# Altium schematic sheet SMPS.SchDoc: LiOn Drill Charger (part 2 of 3)
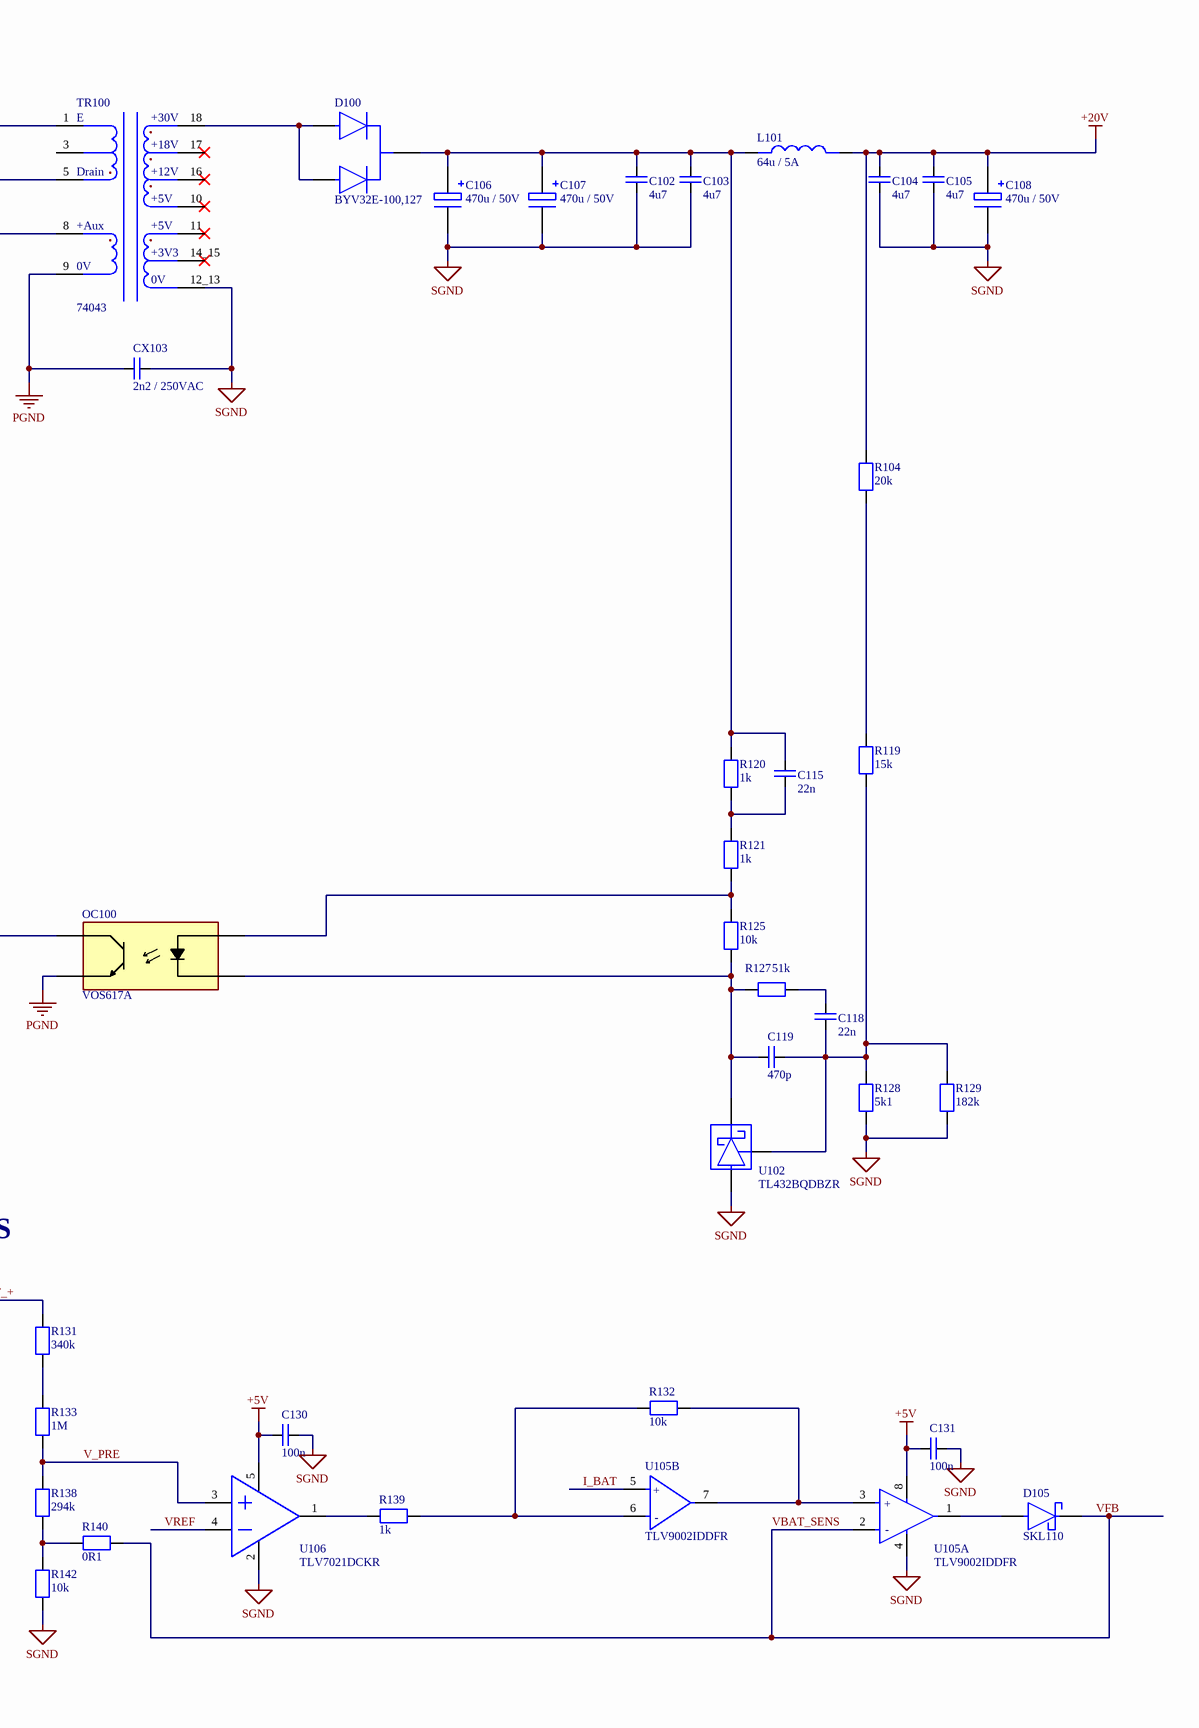
[diagram p2: SMPS.SchDoc, right]
## Library data of the parts
C100 C101 = UCY2G101MHD: Cap Aluminum Lytic 100uF 400V 20% (16 X 35.5mm) Radial 7.5mm 850mA 12000h 105C Automotive Bulk; Manufacturer: Nichicon; Dielectric Material: Aluminium; Life (Hours): 10000Hour; Dissipation Factor: 0.24%; Leakage Current: 100uA; Lead Diameter: 0.8mm; Lead Length: 19mm; Supplier: Rs; Supplier Part Number: 2437275; Manufacturer Part Number: UCY2G101MHD; RoHS: Yes; Category: Aluminum Electrolytic Capacitors; Stock: 1200; Mounting Technology: Through Hole; Case/Package: Radial; Pins: 2; Min Operating Temperature: -40°C; Max Operating Temperature: 105°C; Value: 100uF; Tolerance: 20%; Ripple Current: 850mA; Package Quantity: 50; Voltage Rating: 400V; Packaging: Bulk; Voltage Rating (DC): 400V; Termination: Radial; Features: General Purpose; Series: CY; Ripple Current (AC): 850mA; Diameter: 16mm; Length: 35.5mm; Height: 35.5mm; Lead Pitch: 7.5mm; Height - Seated (Max): 1.457inch; Radiation Hardening: No; RoHS Compliant: Yes; Reach SVHC Compliant: No; ComponentLink1URL: https://datasheet.ciiva.com/29549/e-cy-29549270.pdf?src-supplier=Digi-Key; ComponentLink1Description: https://datasheet.ciiva.com/29549/e-cy-29549270.pdf?src-supplier=Digi-Key; ComponentLink2URL: https://datasheet.ciiva.com/7907/51405-7907211.pdf?src-supplier=Element14; ComponentLink2Description: https://datasheet.ciiva.com/7907/51405-7907211.pdf?src-supplier=Element14
C102-C105 C121 C124-C126 C128 C129 = CL21A475KBQNNNE: CAP CER 4.7UF 50V X5R 0805; Manufacturer: Samsung; Tolerance: 10%; Supplier: Arrow Electronics; Supplier Part Number: CL21A475KBQNNNE; Manufacturer Part Number: CL21A475KBQNNNE; RoHS: Yes; Category: Ceramic Capacitors; Stock: 102000; Pricing: 2000=0,0433, 4000=0,0472, 10000=0,0427, 14000=0,0384, 50000=0,0353, 100000=0,0321 (USD); Mounting Technology: Surface Mount; Case/Package: 0805; Case Code (Metric): 2012; Case Code (Imperial): 0805; Min Operating Temperature: -55°C; Max Operating Temperature: 85°C; Packaging: Tape and Reel; Value: 4.7uF; Voltage Rating: 50V; Series: CL; Package Quantity: 1; Dielectric: X5R; Length: 2mm; Width: 0.049inch; Thickness: 0.055inch; Depth: 1.25mm; Radiation Hardening: No; RoHS Compliant: Yes; ComponentLink1URL: https://datasheet.ciiva.com/25797/cl21a475kbqnnne-25797730.pdf?src-supplier=Digi-Key; ComponentLink1Description: https://datasheet.ciiva.com/25797/cl21a475kbqnnne-25797730.pdf?src-supplier=Digi-Key; ComponentLink2URL: https://datasheet.ciiva.com/16428/cl21a475kbqnnne-16428877.pdf?src-supplier=Future+Electronics; ComponentLink2Description: https://datasheet.ciiva.com/16428/cl21a475kbqnnne-16428877.pdf?src-supplier=Future+Electronics; ComponentLink3URL: https://datasheet.ciiva.com/26838/getdatasheetpartid-470982-26838620.pdf?src-supplier=Verical; ComponentLink3Description: https://datasheet.ciiva.com/26838/getdatasheetpartid-470982-26838620.pdf?src-supplier=Verical
C106-C108 = PF1H471MNN1220: Kondensator: elektrolityczny; THT; 470uF; 50VDC; Ø12,5x20mm; ±20%; Manufacturer Part Number: PF1H471MNN1220
C109 = MC1206B472K102CT: MULTICOMP         MC1206B472K102CT             SMD Multilayer Ceramic Capacitor, 1206 [3216 Metric], 4700 pF, 1 kV,  10%, X7R, MC Series; Value: 4.7nF; Supplier: Farnell; Supplier Part Number: 1855900; Manufacturer: Multicomp; Manufacturer Part Number: MC1206B472K102CT; RoHS: Yes; Category: Capacitors; Stock: 3235; Pins: 2; Case Code (Metric): 3216; Case Code (Imperial): 1206; Min Operating Temperature: -55°C; Max Operating Temperature: 125°C; Packaging: Cut Tape; Tolerance: 10%; Voltage Rating: 1kV; Dielectric: X7R; Voltage Rating (DC): 1kV; RoHS Compliant: Yes; Reach SVHC Compliant: No; ComponentLink1URL: https://datasheet.ciiva.com/6161/1480386-6161102.pdf?src-supplier=Farnell; ComponentLink1Description: https://datasheet.ciiva.com/6161/1480386-6161102.pdf?src-supplier=Farnell; ComponentLink2URL: https://datasheet.ciiva.com/6161/1480386-6161095.pdf?src-supplier=Farnell; ComponentLink2Description: https://datasheet.ciiva.com/6161/1480386-6161095.pdf?src-supplier=Farnell; ComponentLink3URL: https://datasheet.ciiva.com/46384/1876948-46384360.pdf?src-supplier=Element14; ComponentLink3Description: https://datasheet.ciiva.com/46384/1876948-46384360.pdf?src-supplier=Element14
C110 C111 = EKM107M2AG20RRSHP: Kondensator: elektrolityczny; THT; 100uF; 100VDC; Ø10x20mm; ±20%
C112 C113 = FKP2O101001D00JO00: Kondensator: polipropylenowy; 100pF; 4,5x6x7,2mm; THT; ±5%; 5mm; Manufacturer: WIMA; Supplier: Mouser; Supplier Part Number: 505-FKP2O101001D00JO; Manufacturer Part Number: FKP2O101001D00JO00; RoHS: Yes; Stock: 5923; Pricing: 1=0,55, 10=0,384, 50=0,384, 100=0,254, 1000=0,16, 10000=0,14 (USD)
C114 C116 C117 C120 C122 C123 C127 C130 C131 = CC1206KKX7R0BB104: 1206 0.1 uF 100 V ±10% Tolerance X7R SMT Multilayer Ceramic Capacitor; Manufacturer: Yageo; Voltage: 63V; Value: 100nF; Voltage Rating: 100V; Supplier: Arrow Electronics; Supplier Part Number: CC1206KKX7R0BB104; Manufacturer Part Number: CC1206KKX7R0BB104; RoHS: Yes; Category: Ceramic Capacitors; Stock: 512; Pricing: 1=0,1044, 10=0,1034, 25=0,1024, 100=0,0549, 250=0,0544, 500=0,0385, 1000=0,0319, 3000=0,0261 (USD); Mounting Technology: Surface Mount; Case/Package: 1206; Pins: 2; Case Code (Metric): 3216; Case Code (Imperial): 1206; Dielectric Material: Ceramic; Min Operating Temperature: -55°C; Max Operating Temperature: 125°C; Package Quantity: 1; Tolerance: 10%; Packaging: Tape and Reel; Dielectric: X7R; Series: CC; Voltage Rating (DC): 100V; Termination: SMD/SMT; Length: 3.2mm; Width: 0.063inch; Height: 1.25mm; Depth: 1.6mm; Thickness: 0.057inch; Radiation Hardening: No; RoHS Compliant: Yes; Reach SVHC Compliant: No; Lead Free: Lead Free; ComponentLink1URL: https://datasheet.ciiva.com/7978/1447671-7978227.pdf?src-supplier=Element14; ComponentLink1Description: https://datasheet.ciiva.com/7978/1447671-7978227.pdf?src-supplier=Element14; ComponentLink2URL: https://datasheet.ciiva.com/46391/1919308-46391993.pdf?src-supplier=Element14; ComponentLink2Description: https://datasheet.ciiva.com/46391/1919308-46391993.pdf?src-supplier=Element14; ComponentLink3URL: https://datasheet.ciiva.com/180/mlccorderingcode-180145.pdf?src-supplier=Digi-Key; ComponentLink3Description: https://datasheet.ciiva.com/180/mlccorderingcode-180145.pdf?src-supplier=Digi-Key; ComponentLink4URL: https://datasheet.ciiva.com/180/mlccorderingcode-180144.pdf?src-supplier=Digi-Key; ComponentLink4Description: https://datasheet.ciiva.com/180/mlccorderingcode-180144.pdf?src-supplier=Digi-Key; ComponentLink5URL: https://datasheet.ciiva.com/180/mlccorderingcode-180146.pdf?src-supplier=Digi-Key; ComponentLink5Description: https://datasheet.ciiva.com/180/mlccorderingcode-180146.pdf?src-supplier=Digi-Key; ComponentLink6URL: https://datasheet.ciiva.com/5425/upy-gp-np0-16v-to-50v-8-5425573.pdf?src-supplier=Mouser; ComponentLink6Description: https://datasheet.ciiva.com/5425/upy-gp-np0-16v-to-50v-8-5425573.pdf?src-supplier=Mouser; ComponentLink7URL: https://datasheet.ciiva.com/16981/upy-np0x7r-mv-100-to-630v-9-16981180.pdf?src-supplier=Future+Electronics; ComponentLink7Description: https://datasheet.ciiva.com/16981/upy-np0x7r-mv-100-to-630v-9-16981180.pdf?src-supplier=Future+Electronics; ComponentLink8URL: https://datasheet.ciiva.com/26829/getdatasheetpartid-403790-26829655.pdf?src-supplier=Verical; ComponentLink8Description: https://datasheet.ciiva.com/26829/getdatasheetpartid-403790-26829655.pdf?src-supplier=Verical
C115 C118 = 06035C223K4T2A: Cap Ceramic 0.022uF 50V X7R 10% SMD 0603 125C Paper T/R; Manufacturer: Kyocera AVX; Value: 22nF; Supplier: Arrow Electronics; Supplier Part Number: 06035C223K4T2A; Manufacturer Part Number: 06035C223K4T2A; RoHS: Yes; Category: Ceramic Capacitors; Stock: 552000; Pricing: 4000=0,0111, 8000=0,0091, 12000=0,009, 20000=0,0089, 24000=0,0088, 100000=0,0061 (USD); Mounting Technology: Surface Mount; Case/Package: 0603; Case Code (Imperial): 0603; Case Code (Metric): 1608; Min Operating Temperature: -55°C; Max Operating Temperature: 125°C; Tolerance: 10%; Dielectric: X7R; Voltage Rating (DC): 50V; Packaging: Tape and Reel; Package Quantity: 1; Voltage Rating: 50V; Termination: SMD/SMT; Series: -; Length: 1.6mm; Width: 0.032inch; Thickness: 0.035inch; Depth: 0.81mm; Ratings: AEC-Q200; Radiation Hardening: No; Lead Free: Lead Free; RoHS Compliant: Yes; ComponentLink1URL: https://datasheet.ciiva.com/15212/getdatasheetpartid-307471-15212309.pdf?src-supplier=Verical; ComponentLink1Description: https://datasheet.ciiva.com/15212/getdatasheetpartid-307471-15212309.pdf?src-supplier=Verical; ComponentLink2URL: https://datasheet.ciiva.com/5418/cx7r-5418087.pdf?src-supplier=Mouser; ComponentLink2Description: https://datasheet.ciiva.com/5418/cx7r-5418087.pdf?src-supplier=Mouser; ComponentLink3URL: https://datasheet.ciiva.com/6256/cx7r-6256472.pdf?src-supplier=Digi-Key; ComponentLink3Description: https://datasheet.ciiva.com/6256/cx7r-6256472.pdf?src-supplier=Digi-Key; ComponentLink4URL: https://datasheet.ciiva.com/6256/cx7r-6256473.pdf?src-supplier=Digi-Key; ComponentLink4Description: https://datasheet.ciiva.com/6256/cx7r-6256473.pdf?src-supplier=Digi-Key; ComponentLink5URL: https://datasheet.ciiva.com/6256/cx7r-6256474.pdf?src-supplier=Digi-Key; ComponentLink5Description: https://datasheet.ciiva.com/6256/cx7r-6256474.pdf?src-supplier=Digi-Key
C119 = 06035A471JAT2A: 0603 470 pF 50 V ±5 % Tolerance C0G/NP0 SMT Multilayer Ceramic Capacitor; Manufacturer: Kyocera AVX; Value: 470pF; Tolerance: 5%; Dielectric: C0G; Voltage Rating (DC): 50V; Insulation Resistance: 100GR; Temperature Coefficient: 30ppm/°C; Supplier: Arrow Electronics; Supplier Part Number: 06035A471JAT2A; Manufacturer Part Number: 06035A471JAT2A; RoHS: Yes; Category: Ceramic Capacitors; Stock: 6810; Pricing: 1=0,0696, 10=0,0482, 25=0,0477, 100=0,0284, 250=0,0283, 500=0,0236, 1000=0,0191, 3000=0,0168, 6000=0,0167 (USD); Mounting Technology: Surface Mount,PCB; Case/Package: 0603; Pins: 2; Case Code (Imperial): 0603; Case Code (Metric): 1608; Min Operating Temperature: -55°C; Max Operating Temperature: 125°C; Packaging: Tape and Reel; Voltage: 50V; Voltage Rating: 50V; Package Quantity: 4000; Termination: SMD/SMT; Series: -; Length: 1.6mm; Width: 0.81mm; Height: 0.63mm; Depth: 0.81mm; Thickness: 0.034inch; Reach SVHC Compliant: No; Lead Free: Lead Free; RoHS Compliant: Yes; ComponentLink1URL: https://datasheet.ciiva.com/11787/0900766b802d4697-11787612.pdf?src-supplier=Rs; ComponentLink1Description: https://datasheet.ciiva.com/11787/0900766b802d4697-11787612.pdf?src-supplier=Rs; ComponentLink2URL: https://datasheet.ciiva.com/1124/26712-1124834.pdf?src-supplier=Element14; ComponentLink2Description: https://datasheet.ciiva.com/1124/26712-1124834.pdf?src-supplier=Element14; ComponentLink3URL: https://datasheet.ciiva.com/1124/26712-1124788.pdf?src-supplier=Element14; ComponentLink3Description: https://datasheet.ciiva.com/1124/26712-1124788.pdf?src-supplier=Element14; ComponentLink4URL: https://datasheet.ciiva.com/5413/ccog-243403-5413894.pdf?src-supplier=Mouser; ComponentLink4Description: https://datasheet.ciiva.com/5413/ccog-243403-5413894.pdf?src-supplier=Mouser; ComponentLink5URL: https://datasheet.ciiva.com/16290/ccog-16290950.pdf?src-supplier=Future+Electronics; ComponentLink5Description: https://datasheet.ciiva.com/16290/ccog-16290950.pdf?src-supplier=Future+Electronics; ComponentLink6URL: https://datasheet.ciiva.com/150/ccog-150440.pdf?src-supplier=Digi-Key; ComponentLink6Description: https://datasheet.ciiva.com/150/ccog-150440.pdf?src-supplier=Digi-Key; ComponentLink7URL: https://datasheet.ciiva.com/150/ccog-150441.pdf?src-supplier=Digi-Key; ComponentLink7Description: https://datasheet.ciiva.com/150/ccog-150441.pdf?src-supplier=Digi-Key; ComponentLink8URL: https://datasheet.ciiva.com/150/ccog-150442.pdf?src-supplier=Digi-Key; ComponentLink8Description: https://datasheet.ciiva.com/150/ccog-150442.pdf?src-supplier=Digi-Key; ComponentLink9URL: https://datasheet.ciiva.com/14600/70001039-14600970.pdf?src-supplier=Allied+Electronics; ComponentLink9Description: https://datasheet.ciiva.com/14600/70001039-14600970.pdf?src-supplier=Allied+Electronics; ComponentLink10URL: https://datasheet.ciiva.com/14587/70001039-14587403.pdf?src-supplier=Allied+Electronics; ComponentLink10Description: https://datasheet.ciiva.com/14587/70001039-14587403.pdf?src-supplier=Allied+Electronics; ComponentLink11URL: https://datasheet.ciiva.com/28546/759117-28546589.pdf?src-supplier=Element14; ComponentLink11Description: https://datasheet.ciiva.com/28546/759117-28546589.pdf?src-supplier=Element14; ComponentLink12URL: https://datasheet.ciiva.com/2987/ccog-2987806.pdf?src-supplier=Avnet; ComponentLink12Description: https://datasheet.ciiva.com/2987/ccog-2987806.pdf?src-supplier=Avnet
CMC100 = EV28-1.5-02-20M: Suppression Choke, Common Mode, 1.5 A , DCR Thru-Hole, Pin, EV/EH Series; Manufacturer: Schaffner; Tolerance: 30%; Value: 20mH; Shielding: Unshielded; Number of Lines: 2; Test Frequency: 10kHz; Voltage Rating (AC): 250V; Self Resonant Frequency: 400Hz; ESR: 282mR; Lead Diameter: 0.8mm; Supplier: Arrow Electronics; Supplier Part Number: EV28-1.5-02-20M; Manufacturer Part Number: EV28-1.5-02-20M; RoHS: Yes; Category: Common Mode Chokes; Stock: 69; Pricing: 1=1,508, 10=1,4774, 25=1,3975, 50=1,3848, 100=1,2728, 500=1,2056 (USD); Mounting Technology: Through Hole; Case/Package: Radial; Min Operating Temperature: -25°C; Max Operating Temperature: 100°C; Max DC Current: 1.5A; Lead/Base Style: Pin; Package Quantity: 96; Packaging: Bulk; Current Rating: 1.5A; Termination: Radial; Max Current Rating: 1.5A; Series: EV; Length: 29.2mm; Width: 21mm; Height: 34.7mm; Depth: 22mm; Lead Pitch: 13mm; Lead Free: Lead Free; RoHS Compliant: Yes; ComponentLink1URL: https://datasheet.ciiva.com/6214/ev2feh+series-6214565.pdf?src-supplier=Digi-Key; ComponentLink1Description: https://datasheet.ciiva.com/6214/ev2feh+series-6214565.pdf?src-supplier=Digi-Key
CX100-CX103 = DE2E3KY222MA3BM02F: Cap Ceramic Suppression X1/Y2 0.0022uF 250VAC E 20% (8 X 5mm) Radial 7.5mm 125 Bulk; Manufacturer: Murata; Value: 2.2nF; Lead/Base Style: Formed Leads; Ratings: X1,Y2; Supplier: Mouser; Supplier Part Number: 81-DE2E3KY222MA3BM2F; Manufacturer Part Number: DE2E3KY222MA3BM02F; RoHS: Yes; Category: Ceramic Capacitors; Stock: 2658; Pricing: 1=0,56, 10=0,371, 50=0,371, 100=0,223, 1000=0,166, 10000=0,166 (USD); Mounting Technology: Through Hole; Case/Package: Radial; Min Operating Temperature: -40°C; Max Operating Temperature: 125°C; Package Quantity: 250; Packaging: Bulk; Tolerance: 20%; Series: KY; Height - Seated (Max): 0.433inch; Lead Pitch: 0.295inch; Reach SVHC Compliant: No; Lead Free: Lead Free; RoHS Compliant: Yes; ComponentLink1URL: https://datasheet.ciiva.com/41797/l0015e-41797324.pdf?src-supplier=Digi-Key; ComponentLink1Description: https://datasheet.ciiva.com/41797/l0015e-41797324.pdf?src-supplier=Digi-Key; ComponentLink2URL: https://datasheet.ciiva.com/29535/c85e-29535582.pdf?src-supplier=Digi-Key; ComponentLink2Description: https://datasheet.ciiva.com/29535/c85e-29535582.pdf?src-supplier=Digi-Key
D100 = BYV32E-100,127: Diode Switching 100V 20A 3-Pin(3+Tab) TO-220AB Tube; Manufacturer: NXP Semiconductors; Max Reverse Current: 30uA; Reverse Recovery Time: 25ns; Peak Non-Repetitive Surge Current: 137A; Supplier: Newark; Supplier Part Number: 70R3674; Manufacturer Part Number: BYV32E-100,127; RoHS: Yes; Category: Rectifier Diodes; Mounting Technology: Through Hole; Case/Package: TO-220AB; Pins: 3; Min Operating Temperature: -40°C; Max Operating Temperature: 150°C; Packaging: Rail/Tube; Forward Current: 20A; Max Repetitive Reverse Voltage (Vrrm): 100V; Package Quantity: 50; Max Surge Current: 137A; Recovery Time: 25ns; Average Rectified Current: 20A; Reverse Voltage: 100V; Max Reverse Voltage (DC): 100V; Radiation Hardening: No; RoHS Compliant: Yes; ComponentLink1URL: https://datasheet.ciiva.com/23719/byv32e-100-23719120.pdf?src-supplier=Newark; ComponentLink1Description: https://datasheet.ciiva.com/23719/byv32e-100-23719120.pdf?src-supplier=Newark; ComponentLink2URL: https://datasheet.ciiva.com/4453/byv32e-100-115058-4453089.pdf?src-supplier=Mouser; ComponentLink2Description: https://datasheet.ciiva.com/4453/byv32e-100-115058-4453089.pdf?src-supplier=Mouser; ComponentLink3URL: https://datasheet.ciiva.com/905/byv32e-100-905747.pdf?src-supplier=Digi-Key; ComponentLink3Description: https://datasheet.ciiva.com/905/byv32e-100-905747.pdf?src-supplier=Digi-Key
D101 = S1M: VR=1000V IF=1A 6.6pF Trr=1.8us P=1.4W; Manufacturer: ON Semiconductor / Fairchild; Reverse Recovery Time: 1.8us; Average Rectified Current: 1A; Max Reverse Voltage (DC): 1kV; Forward Voltage: 1V; Peak Non-Repetitive Surge Current: 30A; Max Reverse Current: 1uA; Recovery Time: 1800ns; Max Surge Current: 40A; Polarity: Standard; Value: 12pF; Power Dissipation: 1.4W; Supplier: Arrow Electronics; Supplier Part Number: S1M; Manufacturer Part Number: S1M; RoHS: Yes; Category: Rectifier Diodes; Stock: 1252500; Pricing: 7500=0,0565, 15000=0,0556, 37500=0,0552, 52500=0,049, 187500=0,0471 (USD); Mounting Technology: Surface Mount; Case/Package: SMA; Pins: 2; Min Operating Temperature: -55°C; Max Operating Temperature: 150°C; Packaging: Tape and Reel; Series: -; Package Quantity: 7500; Max Repetitive Reverse Voltage (Vrrm): 1kV; Forward Current: 1A; Max Forward Surge Current (Ifsm): 30A; Voltage Rating (DC): 1kV; Current Rating: 1A; Output Current: 1A; Termination: SMD/SMT; Current: 1A; Voltage: 1kV; Reverse Voltage: 1kV; Length: 4.75mm; Width: 5.28mm; Height: 2.2mm; Radiation Hardening: No; RoHS Compliant: No; Lead Free: Lead Free; Reach SVHC Compliant: No
D102 D105 = SKL110: Schottky Diode, SOD-123FL, 100V, 1.00A; Manufacturer: Diotec; Supplier: Mouser; Supplier Part Number: 637-SKL110; Manufacturer Part Number: SKL110; RoHS: Yes; Category: Schottky Diodes; Stock: 5538; Pricing: 1=1,49, 10=0,495, 50=0,495, 100=0,355, 1000=0,248, 10000=0,18 (USD)
D103 = BAV21W-TP: Rectifier Diode Small Signal Switching 250V 0.25A 50ns 2-Pin SOD-123 T/R; Manufacturer: MCC; Max Surge Current: 1A; Average Rectified Current: 200mA; Max Reverse Current: 100nA; Power Dissipation: 225mW; Polarity: Standard; Value: 1.5pF; Max Reverse Voltage (DC): 200V; Supplier: Arrow Electronics; Supplier Part Number: BAV21W-TP; Manufacturer Part Number: BAV21W-TP; RoHS: Yes; Category: Rectifier Diodes; Stock: 1191000; Pricing: 3000=0,0322, 9000=0,0271, 24000=0,0247, 45000=0,0217 (USD); Mounting Technology: Surface Mount; Pins: 2; Min Operating Temperature: -55°C; Max Operating Temperature: 150°C; Package Quantity: 3000; Packaging: Tape and Reel; Recovery Time: 50ns; Reverse Recovery Time: 50ns; Voltage Rating (DC): 250V; Current Rating: 200mA; Output Current: 200mA; Voltage: 250V; Reverse Voltage: 250V; Series: -; Length: 3.04mm; Width: 1.4mm; Height: 1.12mm; Lead Free: Lead Free; RoHS Compliant: Yes; ComponentLink1URL: https://datasheet.ciiva.com/911/bav19w-bav21wsod-123-911766.pdf?src-supplier=Digi-Key; ComponentLink1Description: https://datasheet.ciiva.com/911/bav19w-bav21wsod-123-911766.pdf?src-supplier=Digi-Key; ComponentLink2URL: https://datasheet.ciiva.com/911/bav19w-bav21wsod-123-911767.pdf?src-supplier=Digi-Key; ComponentLink2Description: https://datasheet.ciiva.com/911/bav19w-bav21wsod-123-911767.pdf?src-supplier=Digi-Key; ComponentLink3URL: https://datasheet.ciiva.com/14557/70055583-14557980.pdf?src-supplier=Allied+Electronics; ComponentLink3Description: https://datasheet.ciiva.com/14557/70055583-14557980.pdf?src-supplier=Allied+Electronics
D104 = B340LA-13-F: VR=40V IF=3A 200pF; Manufacturer: Diodes; Forward Current: 3A; Max Reverse Current: 2mA; Max Repetitive Reverse Voltage (Vrrm): 40V; Peak Non-Repetitive Surge Current: 70A; Forward Voltage: 450mV; Polarity: Standard; Value: 180pF; Supplier: Arrow Electronics; Supplier Part Number: B340LA-13-F; Manufacturer Part Number: B340LA-13-F; RoHS: Yes; Category: Rectifier Diodes; Stock: 1645; Pricing: 1=0,4591 (USD); Mounting Technology: Surface Mount; Case/Package: SMA; Pins: 2; Weight: 0.002258oz; Min Operating Temperature: -55°C; Max Operating Temperature: 125°C; Packaging: Tape and Reel; Termination: SMD/SMT; Series: -; Package Quantity: 5000; Average Rectified Current: 3A; Max Forward Surge Current (Ifsm): 70A; Voltage Rating (DC): 40V; Current Rating: 3A; Output Current: 3A; Max Reverse Voltage (DC): 40V; Length: 4.6mm; Width: 2.92mm; Height: 2.1mm; Radiation Hardening: No; Reach SVHC Compliant: No; Lead Free: Lead Free; RoHS Compliant: Yes; ComponentLink1URL: https://datasheet.ciiva.com/34302/1538881-34302359.pdf?src-supplier=Jameco; ComponentLink1Description: https://datasheet.ciiva.com/34302/1538881-34302359.pdf?src-supplier=Jameco; ComponentLink2URL: https://datasheet.ciiva.com/26949/getdatasheetpartid-256588-26949354.pdf?src-supplier=Verical; ComponentLink2Description: https://datasheet.ciiva.com/26949/getdatasheetpartid-256588-26949354.pdf?src-supplier=Verical; ComponentLink3URL: https://datasheet.ciiva.com/1177/ds30240-1177478.pdf?src-supplier=Element14; ComponentLink3Description: https://datasheet.ciiva.com/1177/ds30240-1177478.pdf?src-supplier=Element14; ComponentLink4URL: https://datasheet.ciiva.com/16449/ds30240-16449494.pdf?src-supplier=Future+Electronics; ComponentLink4Description: https://datasheet.ciiva.com/16449/ds30240-16449494.pdf?src-supplier=Future+Electronics; ComponentLink5URL: https://datasheet.ciiva.com/914/ds30240-914393.pdf?src-supplier=Digi-Key; ComponentLink5Description: https://datasheet.ciiva.com/914/ds30240-914393.pdf?src-supplier=Digi-Key; ComponentLink6URL: https://datasheet.ciiva.com/914/ds30240-914394.pdf?src-supplier=Digi-Key; ComponentLink6Description: https://datasheet.ciiva.com/914/ds30240-914394.pdf?src-supplier=Digi-Key; ComponentLink7URL: https://datasheet.ciiva.com/914/ds30240-914392.pdf?src-supplier=Digi-Key; ComponentLink7Description: https://datasheet.ciiva.com/914/ds30240-914392.pdf?src-supplier=Digi-Key
DBR100 = KBP206G: Rectifier Bridge Diode Single 600V 2A 4-Pin Case KBP Tube / RECT BRIDGE GPP 600V 2A KBP; Manufacturer: Diodes; Max Reverse Current: 5uA; Max Surge Current: 65A; Forward Voltage: 1.1V; Number of Elements: 1; Reverse Voltage (DC): 420V; Value: 25pF; Supplier: Arrow Electronics; Supplier Part Number: KBP206G; Manufacturer Part Number: KBP206G; RoHS: Yes; Category: Rectifier Diodes; Stock: 129086; Pricing: 1=0,1378, 10=0,1346, 100=0,1305, 500=0,1294 (USD); Mounting Technology: Through Hole; Pins: 4; Min Operating Temperature: -65°C; Max Operating Temperature: 150°C; Forward Current: 2A; Packaging: Rail/Tube; Package Quantity: 35; Max Repetitive Reverse Voltage (Vrrm): 600V; Max Forward Surge Current (Ifsm): 65A; Average Rectified Current: 2A; Peak Non-Repetitive Surge Current: 65A; Termination: Through Hole; Current Rating: 2A; Voltage Rating (DC): 600V; Output Current: 2A; Series: -; Length: 14.75mm; Width: 3.65mm; Height: 10.6mm; Radiation Hardening: No; Lead Free: Lead Free; RoHS Compliant: Yes; ComponentLink1URL: https://datasheet.ciiva.com/27052/1540480-27052403.pdf?src-supplier=Jameco; ComponentLink1Description: https://datasheet.ciiva.com/27052/1540480-27052403.pdf?src-supplier=Jameco; ComponentLink2URL: https://datasheet.ciiva.com/11195/ds21205-11195751.pdf?src-supplier=Avnet; ComponentLink2Description: https://datasheet.ciiva.com/11195/ds21205-11195751.pdf?src-supplier=Avnet; ComponentLink3URL: https://datasheet.ciiva.com/885/ds21205-885834.pdf?src-supplier=Digi-Key; ComponentLink3Description: https://datasheet.ciiva.com/885/ds21205-885834.pdf?src-supplier=Digi-Key; ComponentLink4URL: https://datasheet.ciiva.com/15145/getdatasheetpartid-244272-15145387.pdf?src-supplier=Verical; ComponentLink4Description: https://datasheet.ciiva.com/15145/getdatasheetpartid-244272-15145387.pdf?src-supplier=Verical
F100 = 0001.2707.11: Fuse Miniature Slow Blow Acting 2A 250V Holder Cartridge 5 X 20mm Ceramic Bag CCC/VDE/cULus; Manufacturer: Schurter; Voltage Rating (DC): 300V; Max Power Dissipation: 2.5W; Fuse Type: Cartridge, Ceramic; Fuse Size: 5 x 20mm; Blow Characteristic: TIME DELAY; Approvals: VDE,cURus,CCC; Supplier: Farnell; Supplier Part Number: 4448352; Manufacturer Part Number: 0001.2707.11; RoHS: Yes; Category: Fuses; Stock: 2569; Mounting Technology: Surface Mount,Holder; Case/Package: SMD/SMT; Pins: 2; Weight: 0.035274oz; Body Material: Ceramic; Contact Material: Copper; Contact Plating: Gold; Min Operating Temperature: -55°C; Max Operating Temperature: 125°C; Packaging: Bulk; Current Rating: 2A; Voltage Rating (AC): 250V; Package Quantity: 100; Max Voltage Rating (AC): 250V; Max Voltage Rating (DC): 300V; Current: 2A; Fuse Current: 2A; Voltage Rating: 250V; Series: SMD-SPT; Diameter: 5.2mm; Length: 20mm; Reach SVHC Compliant: No; Lead Free: Lead Free; RoHS Compliant: Yes; ComponentLink1URL: https://datasheet.ciiva.com/3018/typ-smd-spt-3018464.pdf?src-supplier=Avnet; ComponentLink1Description: https://datasheet.ciiva.com/3018/typ-smd-spt-3018464.pdf?src-supplier=Avnet; ComponentLink2URL: https://datasheet.ciiva.com/4486/typ-smd-spt-245512-4486065.pdf?src-supplier=Mouser; ComponentLink2Description: https://datasheet.ciiva.com/4486/typ-smd-spt-245512-4486065.pdf?src-supplier=Mouser; ComponentLink3URL: https://datasheet.ciiva.com/1223/typ-smd-spt-1223716.pdf?src-supplier=Newark; ComponentLink3Description: https://datasheet.ciiva.com/1223/typ-smd-spt-1223716.pdf?src-supplier=Newark; ComponentLink4URL: https://datasheet.ciiva.com/7480/typ-smd-spt-7480053.pdf?src-supplier=Digi-Key; ComponentLink4Description: https://datasheet.ciiva.com/7480/typ-smd-spt-7480053.pdf?src-supplier=Digi-Key; ComponentLink5URL: https://datasheet.ciiva.com/14645/smd-spt-eng-tds-14645957.pdf?src-supplier=Distrelec; ComponentLink5Description: https://datasheet.ciiva.com/14645/smd-spt-eng-tds-14645957.pdf?src-supplier=Distrelec; ComponentLink6URL: https://datasheet.ciiva.com/30182/20typ-smd-spt-30182278.pdf?src-supplier=Onlinecomponents.com; ComponentLink6Description: https://datasheet.ciiva.com/30182/20typ-smd-spt-30182278.pdf?src-supplier=Onlinecomponents.com; ComponentLink7URL: https://datasheet.ciiva.com/48967/70427025-48967127.pdf?src-supplier=Allied+Electronics; ComponentLink7Description: https://datasheet.ciiva.com/48967/70427025-48967127.pdf?src-supplier=Allied+Electronics
L100 = DPO-3.0-22: Fixed Ind 22UH 3A 50 Mohm Th; Manufacturer: Nuvotem; Shielding: Unshielded; DC Resistance (DCR): 50mR; Test Frequency: 10kHz; Supplier: Digi-Key; Supplier Part Number: 1295-1173-ND; Manufacturer Part Number: DPO-3.0-22; RoHS: Yes; Category: Fixed Inductors; Pricing: 1500=0,93 (USD); Mounting Technology: Through Hole; Case/Package: Radial; Min Operating Temperature: -40°C; Max Operating Temperature: 125°C; Packaging: Tray; Value: 22uH; Series: DP; RoHS Compliant: Yes; ComponentLink1URL: http://www.talema.com/uploads/documents/product-datasheets/DP%20Series.pdf?src-supplier=Digi-Key; ComponentLink1Description: http://www.talema.com/uploads/documents/product-datasheets/DP%20Series.pdf?src-supplier=Digi-Key
L101 = DLV-640-M5.0: Dławik: drutowy; THT; 64uH; 5A; 60mΩ; Manufacturer Part Number: DLV-640-M5.0
L102 = 7440650047: Power Choke Shielded Wirewound 4.7uH 30% 100KHz Ferrite 4.6A 23mOhm DCR T/R; Manufacturer: Wurth Electronics; Self Resonant Frequency: 40MHz; Saturation Current: 4.2A; DC Resistance (DCR): 23mR; Supplier: Rs; Supplier Part Number: 6690280; Manufacturer Part Number: 7440650047; RoHS: Yes; Category: Fixed Inductors; Stock: 425; Mounting Technology: Surface Mount; Case/Package: Nonstandard; Pins: 2; Weight: 0.031076oz; Core Material: Ferrite; Min Operating Temperature: -40°C; Max Operating Temperature: 125°C; Packaging: Cut Tape; Tolerance: 30%; Shielding: Shielded; Inductance Tolerance: 30%; Package Quantity: 1; Current Rating: 4.6A; Value: 4.7uH; Max DC Current: 4.6A; Termination: SMD/SMT; Test Frequency: 100kHz; RMS Current (Irms): 4.6A; Series: WE-TPC; ESR: 23mR; Length: 10mm; Width: 10mm; Height: 2.8mm; Height - Seated (Max): 0.122inch; Depth: 10mm; RoHS Compliant: Yes; Reach SVHC Compliant: Unknown; ComponentLink1URL: https://datasheet.ciiva.com/7892/1735580-7892635.pdf?src-supplier=Element14; ComponentLink1Description: https://datasheet.ciiva.com/7892/1735580-7892635.pdf?src-supplier=Element14; ComponentLink2URL: https://datasheet.ciiva.com/13320/7440650047-21682-13320928.pdf?src-supplier=Mouser; ComponentLink2Description: https://datasheet.ciiva.com/13320/7440650047-21682-13320928.pdf?src-supplier=Mouser; ComponentLink3URL: https://datasheet.ciiva.com/1058/7440650047-1058868.pdf?src-supplier=Digi-Key; ComponentLink3Description: https://datasheet.ciiva.com/1058/7440650047-1058868.pdf?src-supplier=Digi-Key; ComponentLink4URL: https://datasheet.ciiva.com/11801/0900766b80d87d95-11801992.pdf?src-supplier=Rs; ComponentLink4Description: https://datasheet.ciiva.com/11801/0900766b80d87d95-11801992.pdf?src-supplier=Rs; ComponentLink5URL: https://datasheet.ciiva.com/1058/7440650047-1058870.pdf?src-supplier=Digi-Key; ComponentLink5Description: https://datasheet.ciiva.com/1058/7440650047-1058870.pdf?src-supplier=Digi-Key; ComponentLink6URL: https://datasheet.ciiva.com/48690/001087268-da-01-ml-we-tpc-smd-speicherdrossel-7440650-de-en-48690651.pdf?src-supplier=Conrad; ComponentLink6Description: https://datasheet.ciiva.com/48690/001087268-da-01-ml-we-tpc-smd-speicherdrossel-7440650-de-en-48690651.pdf?src-supplier=Conrad
OC100 = VOS617A-X001T: Optocoupler DC-IN 1-CH Transistor DC-OUT 4-Pin SSOP T/R; Manufacturer: Vishay Semiconductors; Max Power Dissipation: 170mW; Forward Current: 50mA; Number of Channels: 1; Reverse Breakdown Voltage: 6V; Forward Voltage: 1.18V; Collector Emitter Voltage (VCEO): 80V; Collector Emitter Saturation Voltage: 400mV; Isolation Voltage: 3.75kV; Current Transfer Ratio: 600%; Input Type: DC; Supplier: Mouser; Supplier Part Number: 78-VOS617A-X001T; Manufacturer Part Number: VOS617A-X001T; RoHS: Yes; Category: Optocouplers; Stock: 3649; Pricing: 1=0,64, 10=0,391, 50=0,391, 100=0,225, 1000=0,181, 10000=0,136 (USD); Mounting Technology: Surface Mount; Case/Package: SSOP; Pins: 4; Min Operating Temperature: -55°C; Max Operating Temperature: 110°C; Packaging: Tape and Reel; Max Collector Current: 50mA; Number of Elements: 1; Power Dissipation: 170mW; Max Input Current: 50mA; Input Current: 50mA; Series: -; Max Output Voltage: 80V; Output Current per Channel: 50mA; Collector-emitter Voltage-Max: 400mV; Radiation Hardening: No; Lead Free: Lead Free; RoHS Compliant: Yes; Reach SVHC Compliant: Unknown; ComponentLink1URL: https://datasheet.ciiva.com/15011/vos617a-15011232.pdf?src-supplier=Digi-Key; ComponentLink1Description: https://datasheet.ciiva.com/15011/vos617a-15011232.pdf?src-supplier=Digi-Key; ComponentLink2URL: https://datasheet.ciiva.com/22656/1913334-22656429.pdf?src-supplier=Element14; ComponentLink2Description: https://datasheet.ciiva.com/22656/1913334-22656429.pdf?src-supplier=Element14; ComponentLink3URL: https://datasheet.ciiva.com/30032/vos617a-30032527.pdf?src-supplier=Avnet; ComponentLink3Description: https://datasheet.ciiva.com/30032/vos617a-30032527.pdf?src-supplier=Avnet
PL100-PL104 = Pole lutownicze 3mm
Q100 = 12N65: Tranzystor: N-MOSFET; unipolarny; 650V; 12A; 33,2W; TO220F; Manufacturer Part Number: 12N65
Q101 Q102 = MMBT7002K: MOSFETs (Field Effect Transistor), SOT-23, 60V, 0.3A, N, 0.350W; Manufacturer: Diotec; Continuous Drain Current (ID): 115mA; Supplier: Mouser; Supplier Part Number: 637-MMBT7002K; Manufacturer Part Number: MMBT7002K; RoHS: Yes; Category: MOSFETs; Stock: 2659; Pricing: 1=0,45, 10=0,15, 50=0,15, 100=0,108, 1000=0,075, 10000=0,054 (USD); Case/Package: SOT-23; Drain to Source Voltage (Vdss): 60V; RoHS Compliant: Yes; ComponentLink1URL: https://datasheet.ciiva.com/14092/mmbt7002k-eng-ger-ds-14092746.pdf?src-supplier=Distrelec; ComponentLink1Description: https://datasheet.ciiva.com/14092/mmbt7002k-eng-ger-ds-14092746.pdf?src-supplier=Distrelec
R100 R101 = RC1206JR-071K2L: Res Thick Film 1206 1.2K Ohm 5% 1/4W ±100ppm/°C Molded SMD SMD Paper T/R; Manufacturer: Yageo; Value: 1.2kR; Max Power Dissipation: 250mW; Voltage Rating: 200V; Supplier: Arrow Electronics; Supplier Part Number: RC1206JR-071K2L; Manufacturer Part Number: RC1206JR-071K2L; RoHS: Yes; Category: Chip SMD Resistors; Stock: 235000; Pricing: 5000=0,003 (USD); Case/Package: 1206; Case Code (Metric): 3216; Case Code (Imperial): 1206; Contact Plating: Tin,Matte; Min Operating Temperature: -55°C; Max Operating Temperature: 155°C; Tolerance: 5%; Packaging: Cut Tape; Temperature Coefficient: 100ppm/°C; Resistor Type: Thick Film; Number of Terminations: 2; Series: RC; Power Rating: 250mW; Features: Moisture Resistant; Package Quantity: 1; Termination: SMD/SMT; Resistance Tolerance: 5%; Length: 0.122inch; Width: 0.063inch; Height: 0.026inch; RoHS Compliant: Yes; Lead Free: Lead Free; Reach SVHC Compliant: Unknown; ComponentLink1URL: https://datasheet.ciiva.com/29181/402559-da-01-en-smd-widerstand-chip1206-1-2-kohm-29181465.pdf?src-supplier=Conrad; ComponentLink1Description: https://datasheet.ciiva.com/29181/402559-da-01-en-smd-widerstand-chip1206-1-2-kohm-29181465.pdf?src-supplier=Conrad; ComponentLink2URL: https://datasheet.ciiva.com/2458/pyu-r-int-thick-7-2458693.pdf?src-supplier=Digi-Key; ComponentLink2Description: https://datasheet.ciiva.com/2458/pyu-r-int-thick-7-2458693.pdf?src-supplier=Digi-Key; ComponentLink3URL: https://datasheet.ciiva.com/2458/pyu-r-int-thick-7-2458694.pdf?src-supplier=Digi-Key; ComponentLink3Description: https://datasheet.ciiva.com/2458/pyu-r-int-thick-7-2458694.pdf?src-supplier=Digi-Key; ComponentLink4URL: https://datasheet.ciiva.com/2458/pyu-r-int-thick-7-2458692.pdf?src-supplier=Digi-Key; ComponentLink4Description: https://datasheet.ciiva.com/2458/pyu-r-int-thick-7-2458692.pdf?src-supplier=Digi-Key; ComponentLink5URL: https://datasheet.ciiva.com/7857/444357-7857453.pdf?src-supplier=Element14; ComponentLink5Description: https://datasheet.ciiva.com/7857/444357-7857453.pdf?src-supplier=Element14; ComponentLink6URL: https://datasheet.ciiva.com/7857/444357-7857454.pdf?src-supplier=Element14; ComponentLink6Description: https://datasheet.ciiva.com/7857/444357-7857454.pdf?src-supplier=Element14; ComponentLink7URL: https://datasheet.ciiva.com/17201/pyu-rc1206-51-rohs-l-4-17201319.pdf?src-supplier=Future+Electronics; ComponentLink7Description: https://datasheet.ciiva.com/17201/pyu-rc1206-51-rohs-l-4-17201319.pdf?src-supplier=Future+Electronics
R102 = PMR2S-82K: Rezystor: power metal; THT; 82kΩ; 2W; ±5%; Ø4x11mm; 350ppm/°C; Manufacturer Part Number: PMR02SJ0823A10
R103 R108 = 1206S4J0150T5E: Resistor: thick film; SMD; 1206; 15O; 0.25W; ±5%; -55÷125°C; Manufacturer: Royal Electronic Factory; Supplier: Mouser; Supplier Part Number: 303-1206S4J0150T5E; Manufacturer Part Number: 1206S4J0150T5E; RoHS: Yes; Pricing: 10000=0,002 (USD); RoHS Compliant: Yes
R104 = WR06X2002FTL: Res Thick Film 0603 20K Ohm 1% 0.1W(1/10W) ±100ppm/C Pad SMD T/R; Manufacturer: Walsin Technologies; Value: 20kR; Power Rating: 100mW; Temperature Coefficient: 100ppm/°C; Voltage Rating (DC): 75V; Supplier: Arrow Electronics; Supplier Part Number: WR06X2002FTL; Manufacturer Part Number: WR06X2002FTL; RoHS: Yes; Category: Chip SMD Resistors; Stock: 1975000; Pricing: 5000=0,001 (USD); Case/Package: 0603; Case Code (Metric): 1608; Case Code (Imperial): 0603; Contact Material: Tin; Packaging: Tape and Reel; Tolerance: 1%; Resistor Type: Thick Film; Voltage Rating: 75V; Resistance Tolerance: 1%; Lead Free: Lead Free; RoHS Compliant: Yes; Reach SVHC Compliant: Unknown; ComponentLink1URL: http://www.farnell.com/datasheets/1960319.pdf?src-supplier=Farnell; ComponentLink1Description: http://www.farnell.com/datasheets/1960319.pdf?src-supplier=Farnell; ComponentLink2URL: http://www.farnell.com/datasheets/1960319.pdf?src-supplier=Element14; ComponentLink2Description: http://www.farnell.com/datasheets/1960319.pdf?src-supplier=Element14; ComponentLink3URL: http://www.farnell.com/datasheets/1960319.pdf?src-supplier=Newark; ComponentLink3Description: http://www.farnell.com/datasheets/1960319.pdf?src-supplier=Newark
R105 = 1206S4J0103T5E: Res Thick Film 1206 10K Ohm 5% 0.25W(1/4W) ±100ppm/°C Pad SMD T/R; Manufacturer: Royal Electronic Factory; Supplier: Mouser; Supplier Part Number: 303-1206S4J0103T5E; Manufacturer Part Number: 1206S4J0103T5E; RoHS: Yes; RoHS Compliant: Yes
R106 = 1206S4J0393T5E: Rezystor: thick film; SMD; 1206; 39kΩ; 0,25W; ±5%; -55÷125°C; Manufacturer: Royal Electronic Factory; Supplier: Mouser; Supplier Part Number: 303-1206S4J0393T5E; Manufacturer Part Number: 1206S4J0393T5E; RoHS: Yes; Pricing: 10000=0,002 (USD); RoHS Compliant: Yes
R107 R109 R113 = 1206S4J0332T5E: Cermet resistor 3.3 kΩ SMD 1206 0.25 W 5 % 100 ±ppm/°C Royalohm 1206S4J0332T5E 1 pc(s); Manufacturer: Royal Electronic Factory; Supplier: Mouser; Supplier Part Number: 303-1206S4J0332T5E; Manufacturer Part Number: 1206S4J0332T5E; RoHS: Yes; Pricing: 10000=0,002 (USD); RoHS Compliant: Yes; ComponentLink1URL: https://produktinfo.conrad.com/datenblaetter/1400000-1499999/001460317-da-01-en-SMD_WID_DICKSCH__1_4WS_1206_5__3K3.pdf?src-supplier=Conrad; ComponentLink1Description: https://produktinfo.conrad.com/datenblaetter/1400000-1499999/001460317-da-01-en-SMD_WID_DICKSCH__1_4WS_1206_5__3K3.pdf?src-supplier=Conrad
R110 R135 = 1206S4J0330T5E: Rezystor: thick film; SMD; 1206; 33Ω; 0,25W; ±5%; -55÷125°C; Manufacturer: Royal Electronic Factory; Supplier: Mouser; Supplier Part Number: 303-1206S4J0330T5E; Manufacturer Part Number: 1206S4J0330T5E; RoHS: Yes; Pricing: 10000=0,002 (USD)
R111 R112 = 1206S4F5104T5E: Rezystor: thick film; SMD; 1206; 5,1MΩ; 0,25W; ±1%; -55÷125°C; Manufacturer: Royal Electronic Factory; Supplier: Mouser; Supplier Part Number: 303-1206S4F5104T5E; Manufacturer Part Number: 1206S4F5104T5E; RoHS: No; Pricing: 10000=0,005 (USD)
R114 R125 R130 R132 = WF06P103JTL: Rezystor: thick film; SMD; 0603; 10kΩ; 0,125W; ±5%; -55÷155°C; Manufacturer Part Number: WF06P103JTL
R115 = 1206S4J0202T5E: Rezystor: thick film; SMD; 1206; 2kΩ; 0,25W; ±5%; -55÷125°C; Manufacturer: Royal Electronic Factory; Supplier: Mouser; Supplier Part Number: 303-1206S4J0202T5E; Manufacturer Part Number: 1206S4J0202T5E; RoHS: Yes; Pricing: 10000=0,002 (USD); RoHS Compliant: Yes
R116 R117 = 1206S4J010JT5E: Rezystor: thick film; SMD; 1206; 1Ω; 0,25W; ±5%; -55÷125°C; Manufacturer: Royal Electronic Factory; Supplier: Mouser; Supplier Part Number: 303-1206S4J010JT5E; Manufacturer Part Number: 1206S4J010JT5E; RoHS: Yes; Pricing: 10000=0,002 (USD); RoHS Compliant: Yes
R118 R127 = 0603SAJ0513T5E: Rezystor: thick film; SMD; 0603; 51kΩ; 0,1W; ±5%; -55÷155°C; Manufacturer: Royal Electronic Factory; Supplier: Mouser; Supplier Part Number: 303-0603SAJ0513T5E; Manufacturer Part Number: 0603SAJ0513T5E; RoHS: Yes; Pricing: 10000=0,001 (USD); RoHS Compliant: Yes
R119 = 0603SAJ0153T5E: 0603 15000±5% SMD Resistor; Manufacturer: Royal Electronic Factory; Supplier: Mouser; Supplier Part Number: 303-0603SAJ0153T5E; Manufacturer Part Number: 0603SAJ0153T5E; RoHS: Yes; Pricing: 10000=0,001 (USD); RoHS Compliant: Yes
R120 R121 R134 R136 R139 R143 = WF06P102JTL: Rezystor: thick film; SMD; 0603; 1kΩ; 0,125W; ±5%; -55÷155°C; Manufacturer Part Number: WF06P102JTL
R122 R126 = 0603SAJ0204T5E: Rezystor: thick film; SMD; 0603; 200kΩ; 0,1W; ±5%; -55÷155°C; Manufacturer: Royal Electronic Factory; Supplier: Mouser; Supplier Part Number: 303-0603SAJ0204T5E; Manufacturer Part Number: 0603SAJ0204T5E; RoHS: Yes; Pricing: 10000=0,001 (USD); RoHS Compliant: Yes
R123 = MC0603SAF4993T5E: MULTICOMP   MC0603SAF4993T5E   THICK FILM RESISTOR, 499KOHM, 100mW, 1%; Voltage Rating: 75V; Value: 499kR; Temperature Coefficient: 100ppm/°C; Supplier: Farnell; Supplier Part Number: 1631358; Manufacturer: Multicomp; Manufacturer Part Number: MC0603SAF4993T5E; RoHS: Yes; Category: Resistors; Case/Package: 0603; Pins: 2; Case Code (Metric): 1608; Case Code (Imperial): 0603; Power Rating: 100mW; Resistor Type: Thick Film; Packaging: Cut Tape; Voltage Rating (DC): 75V; Resistance Tolerance: 1%; Series: MC; RoHS Compliant: Yes; Reach SVHC Compliant: Unknown; ComponentLink1URL: https://datasheet.ciiva.com/7776/ta-677-7776879.pdf?src-supplier=Element14; ComponentLink1Description: https://datasheet.ciiva.com/7776/ta-677-7776879.pdf?src-supplier=Element14
R124 = ERJ-3EKF3573V: Res Thick Film 0603 357K Ohm 1% 1/10W ±100ppm/°C Molded SMD Punched Carrier T/R; Manufacturer: Panasonic; Voltage Rating: 75V; Value: 357kR; Power Rating: 100mW; Voltage Rating (DC): 50V; Supplier: Mouser; Supplier Part Number: 667-ERJ-3EKF3573V; Manufacturer Part Number: ERJ-3EKF3573V; RoHS: Yes; Category: Chip SMD Resistors; Stock: 49267; Pricing: 1=0,1, 10=0,026, 50=0,026, 100=0,012, 1000=0,009, 10000=0,005 (USD); Mounting Technology: Surface Mount; Case/Package: 0603; Case Code (Metric): 1608; Case Code (Imperial): 0603; Contact Plating: Tin; Min Operating Temperature: -55°C; Max Operating Temperature: 155°C; Packaging: Tape and Reel; Tolerance: 1%; Package Quantity: 1; Resistor Type: Thick Film; Number of Terminations: 2; Termination: SMD/SMT; Temperature Coefficient: 100ppm/°C; Max Power Dissipation: 100mW; Features: Automotive AEC-Q200; Series: ERJ; Resistance Tolerance: 1%; Construction: Rectangular; Technology: THICK FILM; Length: 1.6mm; Width: 0.8mm; Height: 0.45mm; Depth: 0.8mm; Reach SVHC Compliant: Yes; Military Standard: Not; Lead Free: Lead Free; RoHS Compliant: Yes; ComponentLink1URL: https://datasheet.ciiva.com/22673/1678782-22673989.pdf?src-supplier=Element14; ComponentLink1Description: https://datasheet.ciiva.com/22673/1678782-22673989.pdf?src-supplier=Element14; ComponentLink2URL: https://datasheet.ciiva.com/9182/aoa0000ce2-9182758.pdf?src-supplier=Avnet; ComponentLink2Description: https://datasheet.ciiva.com/9182/aoa0000ce2-9182758.pdf?src-supplier=Avnet; ComponentLink3URL: https://datasheet.ciiva.com/30192/aoa0000ce2-30192230.pdf?src-supplier=Onlinecomponents.com; ComponentLink3Description: https://datasheet.ciiva.com/30192/aoa0000ce2-30192230.pdf?src-supplier=Onlinecomponents.com; ComponentLink4URL: https://datasheet.ciiva.com/16787/70260748-16787383.pdf?src-supplier=Allied+Electronics; ComponentLink4Description: https://datasheet.ciiva.com/16787/70260748-16787383.pdf?src-supplier=Allied+Electronics; ComponentLink5URL: https://datasheet.ciiva.com/24027/aoa0000ce2-24027115.pdf?src-supplier=Mouser; ComponentLink5Description: https://datasheet.ciiva.com/24027/aoa0000ce2-24027115.pdf?src-supplier=Mouser; ComponentLink6URL: https://datasheet.ciiva.com/16778/70260748-16778909.pdf?src-supplier=Allied+Electronics; ComponentLink6Description: https://datasheet.ciiva.com/16778/70260748-16778909.pdf?src-supplier=Allied+Electronics; ComponentLink7URL: https://datasheet.ciiva.com/46373/1678782-46373405.pdf?src-supplier=Element14; ComponentLink7Description: https://datasheet.ciiva.com/46373/1678782-46373405.pdf?src-supplier=Element14; ComponentLink8URL: https://datasheet.ciiva.com/46373/1678782-46373406.pdf?src-supplier=Element14; ComponentLink8Description: https://datasheet.ciiva.com/46373/1678782-46373406.pdf?src-supplier=Element14
R128 = 0603SAJ0512T5E: 0603 5100±5% SMD Resistor; Manufacturer: Royal Electronic Factory; Supplier: Mouser; Supplier Part Number: 303-0603SAJ0512T5E; Manufacturer Part Number: 0603SAJ0512T5E; RoHS: Yes; Pricing: 10000=0,001 (USD); RoHS Compliant: Yes
R129 = 0603SAF1823T5E: Rezystor: thick film; SMD; 0603; 182kΩ; 0,1W; ±1%; -55÷155°C; Manufacturer: Royal Ohm; Supplier: Mouser; Supplier Part Number: 303-0603SAF1823T5E; Manufacturer Part Number: 0603SAF1823T5E; Pricing: 10000=0,001 (USD); ComponentLink1URL: https://datasheet.octopart.com/0603SAF1823T5E-Royal-Ohm-datasheet-165785611.pdf?src-supplier=TME; ComponentLink1Description: https://datasheet.octopart.com/0603SAF1823T5E-Royal-Ohm-datasheet-165785611.pdf?src-supplier=TME; ComponentLink2URL: https://datasheet.octopart.com/0603SAF1823T5E-Royal-Ohm-datasheet-157855877.pdf?src-supplier=TME; ComponentLink2Description: https://datasheet.octopart.com/0603SAF1823T5E-Royal-Ohm-datasheet-157855877.pdf?src-supplier=TME; ComponentLink3URL: https://datasheet.octopart.com/0603SAF1823T5E-Royal-Ohm-datasheet-62069544.pdf?src-supplier=TME; ComponentLink3Description: https://datasheet.octopart.com/0603SAF1823T5E-Royal-Ohm-datasheet-62069544.pdf?src-supplier=TME
R131 = RC0805FR-07340KL: Res Thick Film 0805 340K Ohm 1% 0.125W(1/8W) ±100ppm/C Pad SMD T/R; Manufacturer: Yageo; Value: 340kR; Temperature Coefficient: 100ppm/°C; Power Rating: 125mW; Voltage Rating: 150V; Supplier: Arrow Electronics; Supplier Part Number: RC0805FR-07340KL; Manufacturer Part Number: RC0805FR-07340KL; RoHS: Yes; Category: Chip SMD Resistors; Stock: 105000; Pricing: 5000=0,004, 10000=0,0026, 25000=0,0025 (USD); Case/Package: 0805; Contact Plating: Tin,Lead; Case Code (Imperial): 0805; Case Code (Metric): 2012; Min Operating Temperature: -55°C; Max Operating Temperature: 155°C; Tolerance: 1%; Packaging: Tape and Reel; Termination: SMD/SMT; Voltage Rating (DC): 150V; Features: Moisture Resistant; Series: RC; Max Power Dissipation: 125mW; Number of Terminations: 2; Length: 2mm; Width: 1.25mm; Height: 0.5mm; Lead Free: Lead Free; RoHS Compliant: Yes; ComponentLink1URL: https://datasheet.ciiva.com/5562/rc0805-257173-5562841.pdf?src-supplier=Mouser; ComponentLink1Description: https://datasheet.ciiva.com/5562/rc0805-257173-5562841.pdf?src-supplier=Mouser; ComponentLink2URL: https://datasheet.ciiva.com/17086/rc0805-17086245.pdf?src-supplier=Future+Electronics; ComponentLink2Description: https://datasheet.ciiva.com/17086/rc0805-17086245.pdf?src-supplier=Future+Electronics
R133 = 0805S8J0105T5E: Rezystor: thick film; SMD; 0805; 1MΩ; 0,125W; ±5%; -55÷125°C; Manufacturer: Royal Electronic Factory; Supplier: Mouser; Supplier Part Number: 303-0805S8J0105T5E; Manufacturer Part Number: 0805S8J0105T5E; RoHS: Yes; Pricing: 10000=0,002 (USD); RoHS Compliant: Yes
R137 R140 R141 = CS06JTFUR100: Rezystor: thick film; pomiarowy; SMD; 1206; 100mΩ; 0,5W; ±5%; Manufacturer: Viking Tech; Supplier: Future Electronics; Supplier Part Number: 8172335; Manufacturer Part Number: CS06JTFUR100; RoHS: No; Category: Uncategorized; Pricing: 5000=0,0356, 10000=0,0347, 20000=0,0339, 25000=0,0336, 75000=0,032 (USD)
R138 = ERA-6AEB2943V: Res Thin Film 0805 294K Ohm 0.1% 1/8W ±25ppm/°C Molded SMD SMD Punched Carrier T/R; Manufacturer: Panasonic; Value: 294kR; Power Rating: 125mW; Voltage Rating: 100V; Supplier: Mouser; Supplier Part Number: 667-ERA-6AEB2943V; Manufacturer Part Number: ERA-6AEB2943V; RoHS: Yes; Category: Chip SMD Resistors; Stock: 379; Pricing: 1=0,33, 10=0,147, 50=0,147, 100=0,066, 1000=0,046, 10000=0,036 (USD); Mounting Technology: Surface Mount; Case/Package: 0805; Pins: 2; Contact Plating: Tin; Case Code (Metric): 2012; Case Code (Imperial): 0805; Weight: 0.000194oz; Min Operating Temperature: -55°C; Max Operating Temperature: 155°C; Tolerance: 0.1%; Resistor Type: Thin Film; Temperature Coefficient: 25ppm/°C; Packaging: Tape and Reel; Package Quantity: 5000; Number of Terminations: 2; Termination: SMD/SMT; Max Power Dissipation: 125mW; Voltage Rating (DC): 100V; Features: Automotive AEC-Q200; Series: ERA-6A; Resistance Tolerance: 0.1%; Technology: METAL FILM; Length: 2mm; Width: 1.25mm; Height: 0.5mm; Depth: 1.25mm; Reach SVHC Compliant: No; Lead Free: Lead Free; ComponentLink1URL: https://datasheet.ciiva.com/11810/0900766b80eb1d8c-11810139.pdf?src-supplier=Rs; ComponentLink1Description: https://datasheet.ciiva.com/11810/0900766b80eb1d8c-11810139.pdf?src-supplier=Rs; ComponentLink2URL: https://datasheet.ciiva.com/41450/001181386-da-01-en-widerstand-era-0805-294k-0-1-5000st-41450544.pdf?src-supplier=Conrad; ComponentLink2Description: https://datasheet.ciiva.com/41450/001181386-da-01-en-widerstand-era-0805-294k-0-1-5000st-41450544.pdf?src-supplier=Conrad; ComponentLink3URL: https://datasheet.ciiva.com/5981/485442-5981333.pdf?src-supplier=Farnell; ComponentLink3Description: https://datasheet.ciiva.com/5981/485442-5981333.pdf?src-supplier=Farnell; ComponentLink4URL: https://datasheet.ciiva.com/5981/485442-5981334.pdf?src-supplier=Farnell; ComponentLink4Description: https://datasheet.ciiva.com/5981/485442-5981334.pdf?src-supplier=Farnell; ComponentLink5URL: https://datasheet.ciiva.com/5981/485442-5981335.pdf?src-supplier=Farnell; ComponentLink5Description: https://datasheet.ciiva.com/5981/485442-5981335.pdf?src-supplier=Farnell; ComponentLink6URL: https://datasheet.ciiva.com/5981/485442-5981336.pdf?src-supplier=Farnell; ComponentLink6Description: https://datasheet.ciiva.com/5981/485442-5981336.pdf?src-supplier=Farnell; ComponentLink7URL: https://datasheet.ciiva.com/9183/aoa0000ce26-9183386.pdf?src-supplier=Avnet; ComponentLink7Description: https://datasheet.ciiva.com/9183/aoa0000ce26-9183386.pdf?src-supplier=Avnet; ComponentLink8URL: https://datasheet.ciiva.com/7712/485442-7712733.pdf?src-supplier=Element14; ComponentLink8Description: https://datasheet.ciiva.com/7712/485442-7712733.pdf?src-supplier=Element14; ComponentLink9URL: https://datasheet.ciiva.com/24129/aoa0000ce26-24129629.pdf?src-supplier=Mouser; ComponentLink9Description: https://datasheet.ciiva.com/24129/aoa0000ce26-24129629.pdf?src-supplier=Mouser; ComponentLink10URL: https://datasheet.ciiva.com/7712/485442-7712734.pdf?src-supplier=Element14; ComponentLink10Description: https://datasheet.ciiva.com/7712/485442-7712734.pdf?src-supplier=Element14